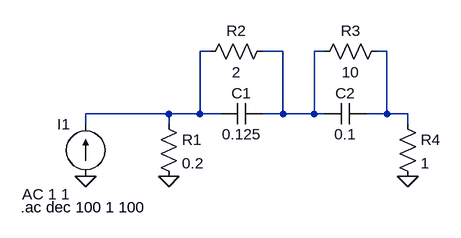
[diagram p0: schematic Ej1.asc]
Ej1.asc, the LTspice schematic file:
Version 4
SHEET 1 880 680
WIRE 256 32 240 32
WIRE 368 32 336 32
WIRE 432 32 416 32
WIRE 528 32 512 32
WIRE 192 128 64 128
WIRE 240 128 240 32
WIRE 240 128 192 128
WIRE 272 128 240 128
WIRE 368 128 368 32
WIRE 368 128 336 128
WIRE 416 128 416 32
WIRE 416 128 368 128
WIRE 432 128 416 128
WIRE 528 128 528 32
WIRE 528 128 496 128
WIRE 560 128 528 128
WIRE 64 144 64 128
WIRE 192 144 192 128
WIRE 560 144 560 128
FLAG 64 224 0
FLAG 192 224 0
FLAG 560 224 0
SYMBOL current 64 224 R180
WINDOW 0 24 80 Left 2
WINDOW 3 24 0 Left 2
WINDOW 123 24 -28 Left 2
WINDOW 39 0 0 Left 0
SYMATTR InstName I1
SYMATTR Value ""
SYMATTR Value2 AC 1 1
SYMBOL res 176 128 R0
SYMATTR InstName R1
SYMATTR Value 0.2
SYMBOL cap 336 112 R90
WINDOW 0 0 32 VBottom 2
WINDOW 3 32 32 VTop 2
SYMATTR InstName C1
SYMATTR Value 0.125
SYMBOL cap 496 112 R90
WINDOW 0 0 32 VBottom 2
WINDOW 3 32 32 VTop 2
SYMATTR InstName C2
SYMATTR Value 0.1
SYMBOL res 240 48 R270
WINDOW 0 32 56 VTop 2
WINDOW 3 0 56 VBottom 2
SYMATTR InstName R2
SYMATTR Value 2
SYMBOL res 416 48 R270
WINDOW 0 32 56 VTop 2
WINDOW 3 0 56 VBottom 2
SYMATTR InstName R3
SYMATTR Value 10
SYMBOL res 544 128 R0
SYMATTR InstName R4
SYMATTR Value 1
TEXT -36 272 Left 2 !.ac dec 100 1 100

The netlist it stands for:
* Ej1.asc
I1 0 N001 AC 1 1
R1 N001 0 0.2
C1 N002 N001 0.125
C2 N003 N002 0.1
R2 N001 N002 2
R3 N002 N003 10
R4 N003 0 1
.ac dec 100 1 100
.backanno
.end